# Altium project mt-kgreen-01.PrjPcb
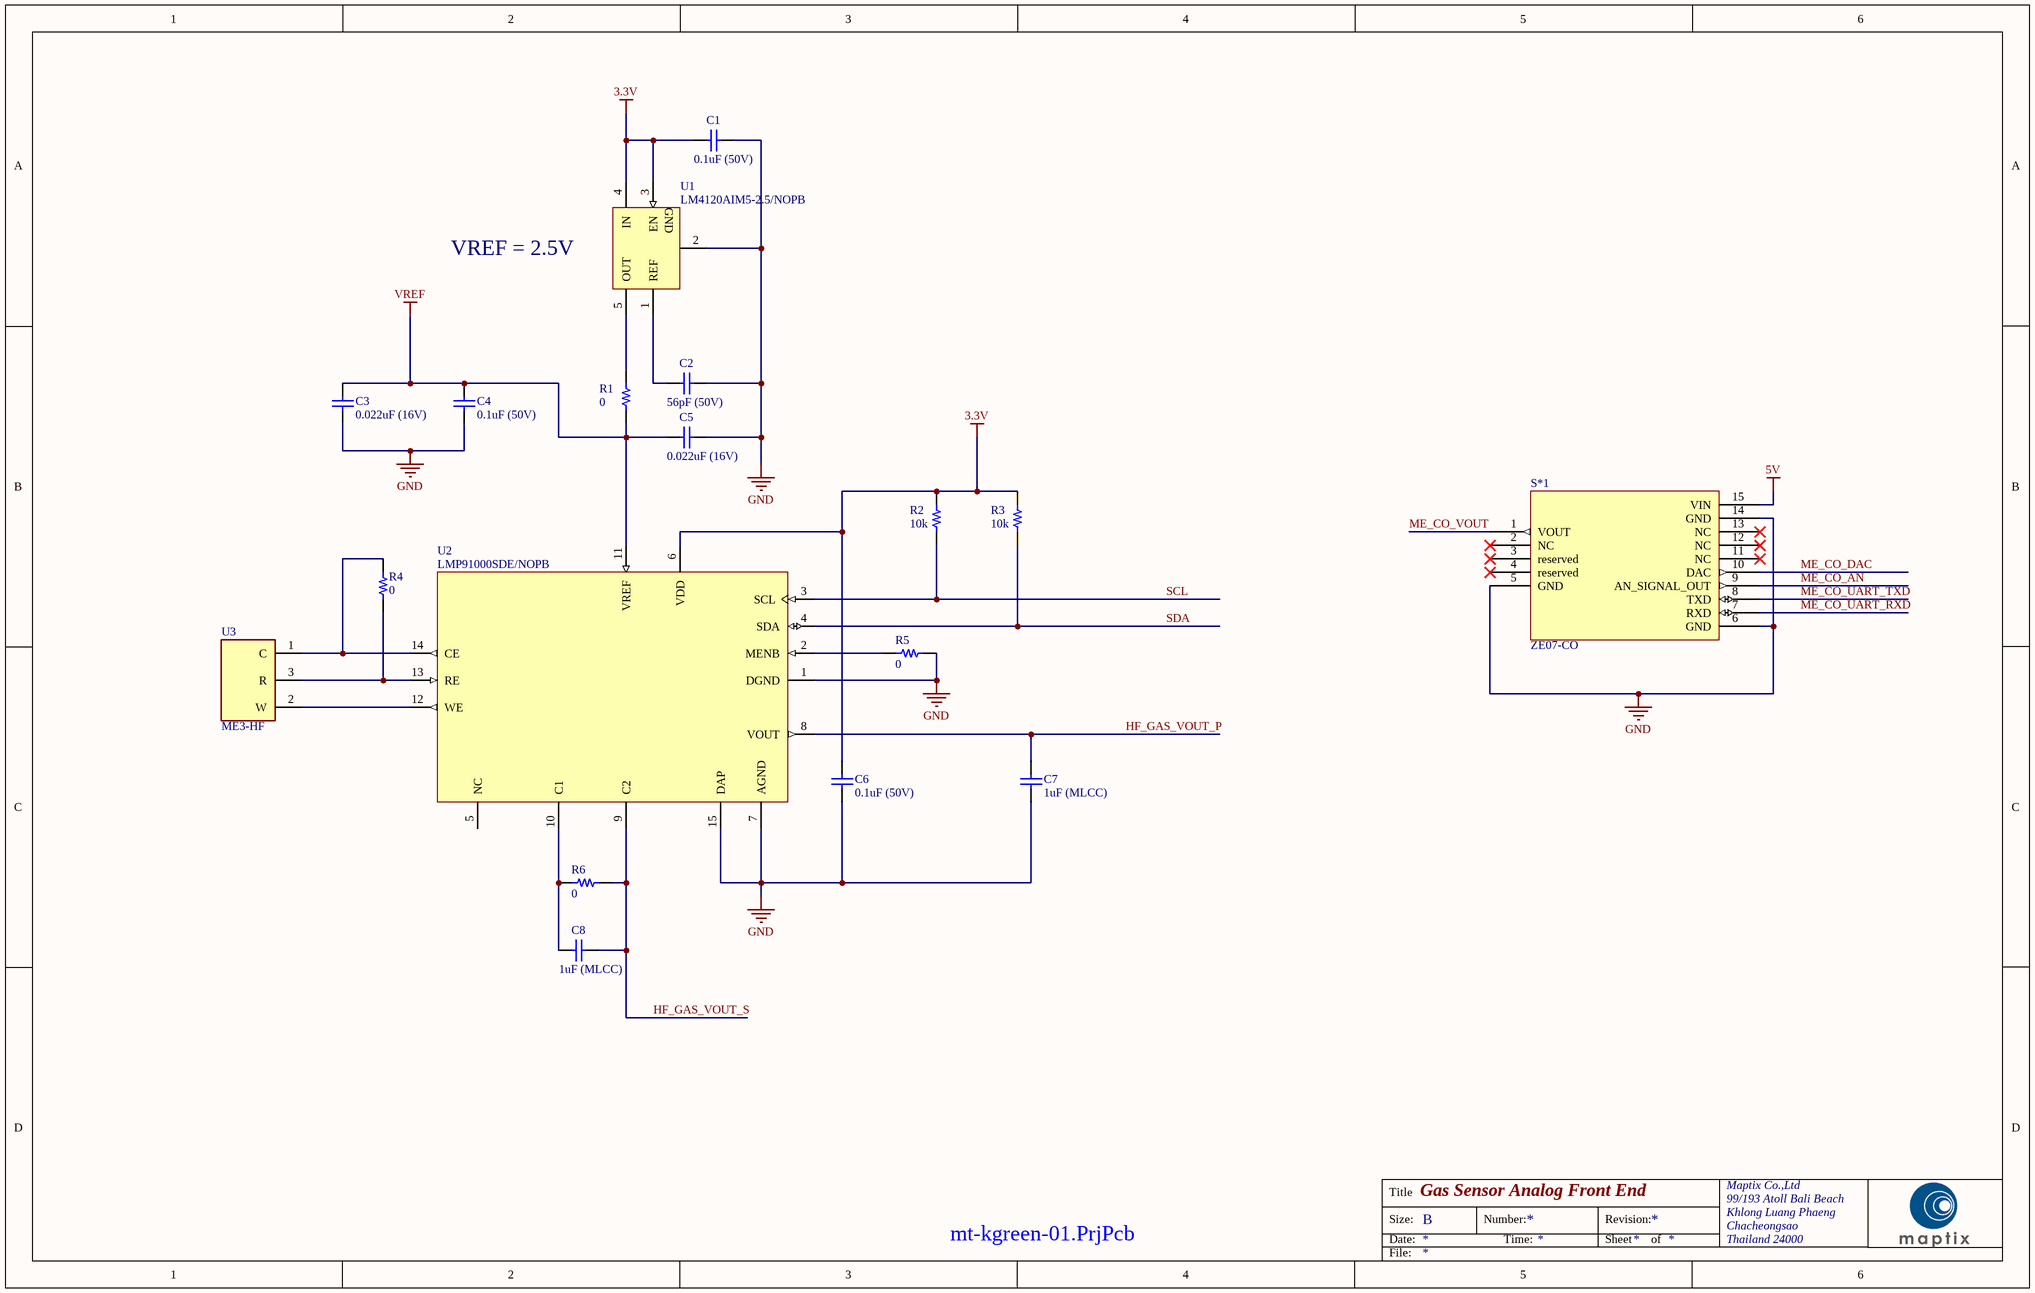
[diagram p0: gas-sensor.SchDoc]
4 sheets, 78 parts. Net scope: global (net labels, ports and power ports of the same name join across sheets).
Board file: mt-kugreen-01.PcbDoc
Sheets:
  gas-sensor.SchDoc
  power-supply.SchDoc
  Controller.SchDoc
  communication.SchDoc

## Sheet gas-sensor.SchDoc: Gas Sensor Analog Front End
size B

### Parts
C1  0.1uF (50V)  [CAPC1608X95X40NL15T15]
C2  56pF (50V)  [CAPC1608X95X40NL15T15]
C3  0.022uF (16V)  [CAPC1608X95X40NL15T15]
C4  0.1uF (50V)  [CAPC1608X95X40NL15T15]
C5  0.022uF (16V)  [CAPC1608X95X40NL15T15]
C6  0.1uF (50V)  [CAPC1608X95X40NL15T15]
C7  1uF (MLCC)  [CAPC1608X95X40NL15T15]
C8  1uF (MLCC)  [CAPC1608X95X40NL15T15]
R1  0  [RES 0603_1608]
R2  10k  [RES 0603_1608]
R3  10k  [RES 0603_1608]
R4  0  [RES 0603_1608]
R5  0  [RES 0603_1608]
R6  0  [RES 0603_1608]
S*1  ZE07-CO  [ZE07-CO]
U1  LM4120AIM5-2.5/NOPB  [MF05A_M]
U2  LMP91000SDE/NOPB  [NHL0014B_V_Pae]
U3  ME3-HF  [ME3SO2]

### Nets
3.3V: C1.2 C6.2 R2.2 R3.2 U1.3(EN) U1.4(IN) U2.6(VDD)
5V: S*1.15(VIN)
GND: C1.1 C2.1 C3.2 C4.1 C5.1 C6.1 C7.2 R5.1 S*1.5(GND) S*1.6(GND) S*1.14(GND) U1.2(GND) U2.1(DGND) U2.7(AGND) U2.15(DAP)
VREF: C3.1 C4.2 C5.2 R1.1 U2.11(VREF)
HF_GAS_VOUT_P: C7.1 U2.8(VOUT)
HF_GAS_VOUT_S: C8.1 R6.1 U2.9(C2)
ME_CO_AN: S*1.9(AN_SIGNAL_OUT)
ME_CO_DAC: S*1.10(DAC)
ME_CO_UART_RXD: S*1.7(RXD)
ME_CO_UART_TXD: S*1.8(TXD)
ME_CO_VOUT: S*1.1(VOUT)
SCL: R2.1 U2.3(SCL)
SDA: R3.1 U2.4(SDA)
NetC2_2: C2.2 U1.1(REF)
NetC8_2: C8.2 R6.2 U2.10(C1)
NetR1_2: R1.2 U1.5(OUT)
NetR4_1: R4.1 U2.14(CE) U3.1(C)
NetR4_2: R4.2 U2.13(RE) U3.3(R)
NetR5_2: R5.2 U2.2(MENB)
NetU2_12: U2.12(WE) U3.2(W)

Not connected (* = marked no-connect by the designer): S*1 2(NC)* 3(reserved)* 4(reserved)* 11(NC)* 12(NC)* 13(NC)*; U2 5(NC)

### Notes on the sheet
- VREF = 2.5V
- Title
- Size:
- Date:
- B
- Number:
- Time:
- Revision:
- Sheet
- of
- Maptix Co.,Ltd
- 99/193 Atoll Bali Beach
- Khlong Luang Phaeng
- Chacheongsao
- Thailand 24000
- File:

### Library data of the parts
C1-C8 = CMP-2006-00072-1: Part Number: VJ0603Y332JXACW1BC; Manufacturer: Vitramon
R1-R6 = CRCW060329K4FKEA: Resistor; Manufacturer: Vishay Dale; Power (Watts): 0.1W, 1/10W; Resistance: 29.4 kOhms; Temperature Coefficient: ±100ppm/°C; Tolerance: ±1%; Part Number: CRCW060329K4FKEA; ComponentLink1Description: Datasheet; ComponentLink1URL: http://www.vishay.com/docs/20035/dcrcwe3.pdf; ComponentLink2Description: DigiKey Link; ComponentLink2URL: http://digikey.com/product-detail/en/vishay-dale/CRCW060329K4FKEA/541-29.4KHCT-ND/1179975; Composition: Thick Film; Device Package: 0603 (1608 Metric); Features: Automotive AEC-Q200; Height - Seated (Max): 0.020" (0.50mm); LastUpdated: 1/2/2020 12:06:58 AM; Lifecycle Status: Active; Minimum Order: 1; Number of Terminations: 2; Operating Temperature: -55°C ~ 155°C; Package / Case: 0603 (1608 Metric); Packaging: TapeAndReel; PartId: 7975; Part Status: Active; Price: 0.00; Ratings: AEC-Q200; Series: CRCW; Size / Dimension: 0.061" L x 0.033" W (1.55mm x 0.85mm); Supplier 1: DigiKey; Supplier Part Number 1: 541-29.4KHCT-ND; Supplier Device Package: 0603
  R1 R4-R6: Value: 0
  R2 R3: Value: 10k
U1 = CMP-0074-00248-2: Precision Micropower Low Dropout Voltage Reference, 5-pin SOT-23, Pb-Free; Manufacturer: National Semiconductor; PowerWise: Y; CompType: Voltage Reference IC; PackageTopMarking: R08A*XTT; PackageVersion: revD, Aug-2008; ComponentLink1Description: LM4120 Datasheet; ComponentLink3Description: MF05A Package Page; DatasheetVersion: Mar-2005; ComponentLink2Description: LM4120 Web Page; PinCount: 5; RevisionNote: Component URLs added; PackageDescription: Molded SOT-23, .115 x .063 x .040 in Body, 5 Lead, .0375 in Pitch; PackageReference: MF05A; RoHS: Y; ComponentLink2URL: http://www.national.com/pf/LM/LM4120.html; ComponentLink3URL: http://www.national.com/packaging/folders/mf05a.html; ComponentLink1URL: http://www.national.com/ds/LM/LM4120.pdf
U2 = CMP-0064-00201-2: Configurable AFE Potentiostat for Low-Power Chemical Sensing Applications, 14-pin LLP, 250 Reel; Manufacturer: Texas Instruments; PowerWise: N; PackageTopMarking: NS*UZXYTT*L91000; CompType: OtherParts; PackageDescription: LLP, Plastic, Dual, 4 x 4 x 0.8mm Body, 14 Lead, 0.5mm Pitch, No Pullback; ComponentLink1URL: http://www.ti.com/general/docs/lit/getliterature.tsp?genericPartNumber=LMP91000&fileType=pdf; ComponentLink1Description: Datasheet URL; PinCount: 14; RoHS: Y; PackageReference: NHL0014B
U3 = ME3-SO2: Undefined or Miscellaneous; Manufacturer_Name: WINSEN; Datasheet Link: http://www.eleparts.co.kr/data/goods_old/design/product_file/SENSOR/gas/ME3-SO2%200-20ppm(ver1.2)%20Manual.pdf; Height: 16.4mm; Manufacturer_Part_Number: ME3-SO2

## Sheet power-supply.SchDoc
size B
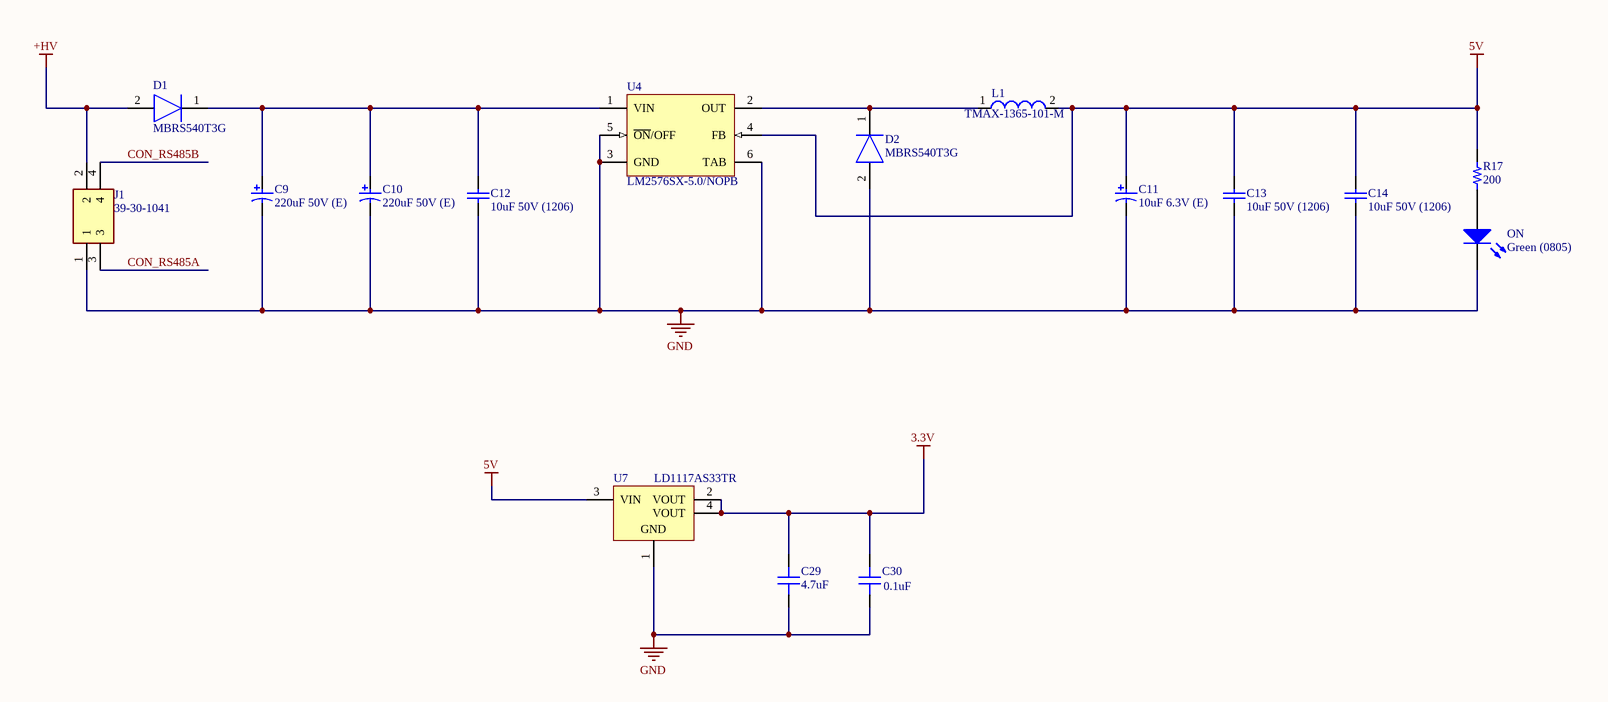
[diagram p1: power-supply.SchDoc]

### Parts
C9  220uF 50V (E)  [PNSC-EEE-1HA221P_L]
C10  220uF 50V (E)  [PNSC-EEE-1HA221P_L]
C11  10uF 6.3V (E)  [NIC-CAPA2-8X10_V]
C12  10uF 50V (1206)  [CAPC3216X229X50LL20T25]
C13  10uF 50V (1206)  [CAPC3216X229X50LL20T25]
C14  10uF 50V (1206)  [CAPC3216X229X50LL20T25]
C29  4.7uF  [CAP 1206_3216 - 1.8MM]
C30  0.1uF  [CAP 0603_1608]
D1  MBRS540T3G  [DIOM7958X256N]
D2  MBRS540T3G  [DIOM7958X256N]
J1  39-30-1041  [39-30-1040]
L1  TMAX-1365-101-M  [WE-HCI-1365]
ON  Green (0805)  [0805_A]
R17  200  [RES 0603_1608]
U4  LM2576SX-5.0/NOPB  [KTT0005B_M]
U7  LD1117AS33TR  [SOT-223_M]

### Nets
3.3V: C29.2 C30.2 U7.2(VOUT) U7.4(VOUT)
5V: C11.1 C13.2 C14.2 L1.2 R17.2 U4.4(FB) U7.3(VIN)
+HV: D1.2(A) J1.2
GND: C9.2 C10.2 C11.2 C12.1 C13.1 C14.1 C29.1 C30.1 D2.2(A) J1.1 ON.1(K) U4.3(GND) U4.5(~{ON}/OFF) U4.6(TAB) U7.1(GND)
CON_RS485A: J1.3
CON_RS485B: J1.4
NetC9_1: C9.1 C10.1 C12.2 D1.1(K) U4.1(VIN)
NetD2_1: D2.1(K) L1.1 U4.2(OUT)
NetON_2: ON.2(A) R17.1

### Notes on the sheet
- Title
- Size:
- Date:
- B
- Number:
- Time:
- Revision:
- Sheet
- of
- Maptix Co.,Ltd
- 99/193 Atoll Bali Beach
- Khlong Luang Phaeng
- Chacheongsao
- Thailand 24000
- File:

### Library data of the parts
C9 C10 = CMP-2000-06200-1: Aluminum Electrolytic Capacitor, 220 uF, +/- 20%, 50 V, -40 to 85 degC, 2-Pin SMD, RoHS, Tape and Reel; Manufacturer: Panasonic; Lifetime @ Temperature: 2000hours@85°C; AE Capacitor Case: RadialCan-SMD; Capacitance: 220µF; Ripple Current AC: 300mA; SVHC: ToBeAdvised; Product Range: PANASONIC-SSeries; Datasheet Version: 11/2012; Manufacturer URL: http://www.panasonic.com/; Packaging: CutTape; Life Time @ Temperature: 2000hours@85°C; Capacitor Case Style: RadialCan-SMD; Capacitance Tolerance ±: ±20%; Mounting Technology: SurfaceMount; Operating Temperature Max: 85°C; Capacitance Tolerance: ±20%; Package Description: 2-Pin Surface Mount Device, Body 10.3 x 10.3 mm; Voltage Rating: 50V; Package Reference: SMD; Diameter: 10mm; Height: 10.2mm; Operating Temperature Min: -40°C; Datasheet URL: http://datasheet.octopart.com/EEE-1HA221P-Panasonic-datasheet-13265900.pdf
C11 = CMP-0687-00071-1: Aluminum Electrolytic Capacitor, UD Series, Low Impedance, 1000 uF, 6.3 V, + / - 20%, -55 to 105 degC, Chip Type, 8 x 10 mm D x L, Pb-Free, Reel; Manufacturer: Nichicon; PartNumber: UUD0J102MNL1GS; Impedance: 0.17 Ohm; Endurance Time: 5000 h; Rated Capacitance: 1000 uF; Rated Ripple Current (at 100kHz): 450 mA; Packing: Dia382mm Reel; Tolerance Rated Capacitance: -20 to 20%; Diameter: 8 mm; ComponentLink3Description: Package Specification; Mounting Technology: Surface Mount; RoHS: TRUE; ComponentLink3URL: http://products.nichicon.co.jp/en/pdf/XJA043/e-ud.pdf; Length: 10 mm; PackageDescription: 2-Pin Surface Mount Device, Diameter 8 mm, Height 10 mm, Pitch 6.5 mm; DatasheetVersion: 08/2012; ComponentLink2Description: Datasheet; ComponentLink1URL: http://www.nichicon.co.jp/; ComponentLink1Description: Manufacturer URL; Rated Voltage: 6.3 V; ComponentLink2URL: http://products.nichicon.co.jp/en/pdf/XJA043/e-ud.pdf; PackageReference: CAPAE-D8H10
C12-C14 = CMP-2000-05863-1: Chip Capacitor, 10 uF, +/- 10%, 25 V, -55 to 85 degC, 1206 (3216 Metric), RoHS, Tape and Reel; Manufacturer: AVX; Rated Voltage: 25V; Dielectric: X5R; Capacitance: 10µF; Mounting Technology: SurfaceMount; Package Reference: 1206; Tolerance (%): ±10%; Manufacturer URL: http://www.avx.com/; Datasheet URL: http://datasheets.avx.com/cx5r.pdf; Package Description: 2-Pin Surface Mount Device, Body 3.2 x 1.6 mm; Datasheet Version: 05/2016; Case Size/Dimension: 1206
C29 = C1206C335K4PACTU: CAP CERAMIC 16V X5R 1206; Manufacturer: KEMET; Capacitance: 3.3µF; Tolerance: ±10%; Part Number: C1206C335K4PACTU; Value: 4.7uF; Applications: General Purpose; ComponentLink1Description: Datasheet; ComponentLink1URL: https://api.kemet.com/component-edge/download/datasheet/C1206C335K4PACTU.pdf; ComponentLink2Description: DigiKey Link; ComponentLink2URL: http://digikey.com/product-detail/en/kemet/C1206C335K4PACTU/399-1264-1-ND/411539; Device Package: 1206 (3216 Metric); LastUpdated: 1/2/2020 12:03:41 AM; Lifecycle Status: Active; Minimum Order: 1; Mounting Type: Surface Mount, MLCC; Operating Temperature: -55°C ~ 85°C; Package / Case: 1206 (3216 Metric); Packaging: ReReel; PartId: 19546; Part Status: Active; Price: 0.00; Series: SMD Comm X5R; Size / Dimension: 0.126" L x 0.063" W (3.20mm x 1.60mm); Supplier 1: DigiKey; Supplier Part Number 1: 399-1264-1-ND; Temperature Coefficient: X5R; Thickness (Max): 0.071" (1.80mm); Voltage - Rated: 16V
C30 = VJ0603Y332JXACW1BC: CAP CERAMIC 50V X7R 0603; Manufacturer: Vishay Vitramon; Capacitance: 3300pF; Tolerance: ±5%; Part Number: VJ0603Y332JXACW1BC; Value: 0.1uF; Applications: General Purpose; ComponentLink1Description: Datasheet; ComponentLink1URL: https://www.vishay.com/docs/28548/vjw1bcbascomseries.pdf; ComponentLink2Description: DigiKey Link; ComponentLink2URL: http://digikey.com/product-detail/en/vishay-vitramon/VJ0603Y332JXACW1BC/720-VJ0603Y332JXACW1BCCT-ND/11198425; Device Package: 0603 (1608 Metric); LastUpdated: 1/2/2020 12:01:35 AM; Lifecycle Status: Active; Minimum Order: 1; Mounting Type: Surface Mount, MLCC; Operating Temperature: -55°C ~ 125°C; Package / Case: 0603 (1608 Metric); Packaging: Unknown; PartId: 26247; Part Status: Active; Price: 0.00; Series: VJ; Size / Dimension: 0.063" L x 0.031" W (1.60mm x 0.80mm); Supplier 1: DigiKey; Supplier Part Number 1: 720-VJ0603Y332JXACW1BCCT-ND; Temperature Coefficient: X7R; Thickness (Max): 0.034" (0.87mm); Voltage - Rated: 50V
D1 D2 = MBRS540T3G: Diode; Manufacturer_Name: ON Semiconductor; Allied_Number: 70100196; Datasheet Link: http://www.onsemi.com/pub/Collateral/MBRS540T3-D.PDF; Height: 2.56mm; Manufacturer_Part_Number: MBRS540T3G; Mouser Part Number: 863-MBRS540T3G; Mouser Price/Stock: https://www.mouser.com/Search/Refine.aspx?Keyword=863-MBRS540T3G; RS Part Number: 6880512; RS Price/Stock: https://uk.rs-online.com/web/p/products/6880512; Allied Price/Stock: http://www.alliedelec.com/on-semiconductor-mbrs540t3g/70100196/
J1 = 39-30-1041: Connector; Manufacturer_Name: Molex; Allied_Number: 70374118; Datasheet Link: http://docs-emea.rs-online.com/webdocs/150e/0900766b8150e03e.pdf; Manufacturer_Part_Number: 39-30-1041; Mouser Part Number: 538-39-30-1041; Mouser Price/Stock: https://www.mouser.com/Search/Refine.aspx?Keyword=538-39-30-1041; RS Part Number: 6705754; RS Price/Stock: https://uk.rs-online.com/web/p/products/6705754; Allied Price/Stock: https://www.alliedelec.com/molex-incorporated-39-30-1041/70374118/
L1 = CMP-1351-00012-1: SMD Flat Wire High Current Inductor WE-HCI, L=33.0 µH; Manufacturer: Wuerth Elektronik; PartNumber: 7443551331; Inductance: 33.0 ÂµH; ComponentLink1Description: Manufacturer URL; ComponentLink1URL: http://www.we-online.com; PackageDescription: Inductor, 2-Leads, Body 13.2 x 12.8 mm; ComponentLink2URL: http://katalog.we-online.de/kataloge/eisos/media/pdf/7443551331.pdf; ComponentLink2Description: Datasheet; PackageReference: WE-HCI-1365
ON = CMP-1426-00007-1: SMD mono-color Chip LED, WL-SMCW, Green; PartNumber: 150080GS75000; Manufacturer: Wuerth Elektronik; PackageReference: 0805_A; Color: Green; ComponentLink2URL: http://katalog.we-online.com/led/datasheet/150080GS75000.pdf; ComponentLink1URL: http://www.we-online.com; ComponentLink1Description: Manufacturer URL; ComponentLink2Description: Datasheet
R17 = CRCW060329K4FKEA: as R1 on sheet gas-sensor; Part Number: CRCW060329K4FKEA; Value: 200; ComponentLink1Description: Datasheet; ComponentLink1URL: http://www.vishay.com/docs/20035/dcrcwe3.pdf; ComponentLink2Description: DigiKey Link; ComponentLink2URL: http://digikey.com/product-detail/en/vishay-dale/CRCW060329K4FKEA/541-29.4KHCT-ND/1179975; Composition: Thick Film; Device Package: 0603 (1608 Metric); Features: Automotive AEC-Q200; Height - Seated (Max): 0.020" (0.50mm); LastUpdated: 1/2/2020 12:06:58 AM; Lifecycle Status: Active; Minimum Order: 1; Number of Terminations: 2; Operating Temperature: -55°C ~ 155°C; Package / Case: 0603 (1608 Metric); Packaging: TapeAndReel; PartId: 7975; Part Status: Active; Price: 0.00; Ratings: AEC-Q200; Series: CRCW; Size / Dimension: 0.061" L x 0.033" W (1.55mm x 0.85mm); Supplier 1: DigiKey; Supplier Part Number 1: 541-29.4KHCT-ND; Supplier Device Package: 0603
U4 = CMP-0069-00122-3: SIMPLE SWITCHER® 3A Step-Down Voltage Regulator, 5-pin TO-263, Pb-Free; Manufacturer: Texas Instruments; PackageTopMarking: NSUZXYTTE#*LM2576S*-5.0 P+; PowerWise: N; PackageDescription: TO-263, Molded, .400 x .390 x .180in, 5 Lead, .067in Pitch, Surface Mount; PinCount: 5; PackageReference: KTT0005B; ComponentLink1Description: Datasheet URL; ComponentLink1URL: http://www.ti.com/general/docs/lit/getliterature.tsp?genericPartNumber=LM2576&fileType=pdf; Code_JEDEC: MO-169-AB; CompType: Switcher; RoHS: Y
U7 = CMP-0244-00316-1: 1A, Low Drop Positive Voltage Regulator, 3.3V, 4-Pin SOT-223, Tape and Reel; ComponentLink1Description: Manufacturer URL; DatasheetVersion: 2/12/2011; PackageVersion: 2010; ComponentLink1URL: http://www.st.com; ComponentLink2Description: Datasheet; ComponentLink2URL: http://www.st.com/internet/com/TECHNICAL_RESOURCES/TECHNICAL_LITERATURE/DATASHEET/CD00002116.pdf; PackageDescription: 4-Pin SOT-223 Package, 6.5 x 3.5 mm Body, 2.3 mm Pitch, 7 mm Lead Span; PackageReference: SOT-223

## Sheet Controller.SchDoc: Controller-Section
size B
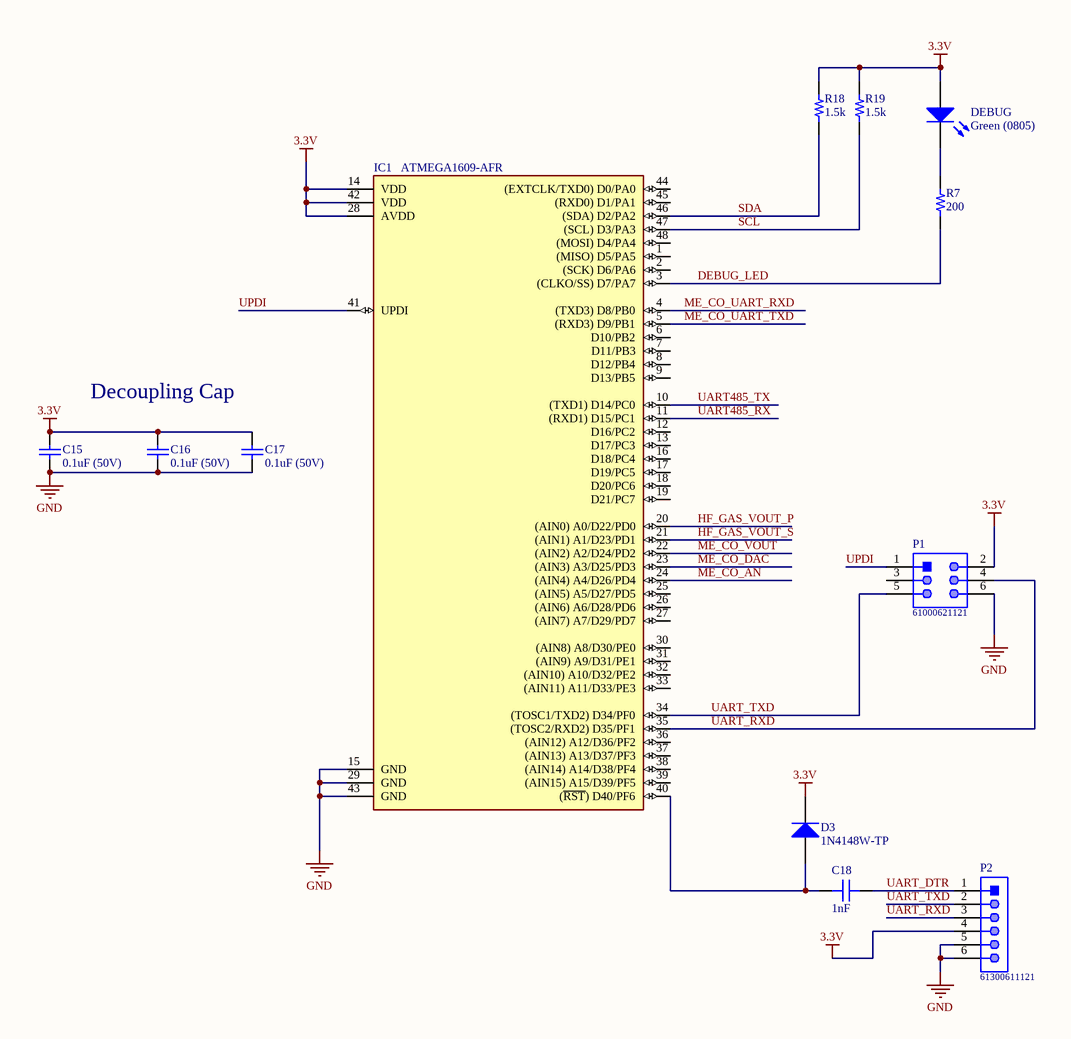
[diagram p2: Controller.SchDoc]

### Parts
C15  0.1uF (50V)  [CAPC1608X95X40NL15T15]
C16  0.1uF (50V)  [CAPC1608X95X40NL15T15]
C17  0.1uF (50V)  [CAPC1608X95X40NL15T15]
C18  1nF  [CAP 0603_1608]
D3  1N4148W-TP  [MCC-SOD123_V]
DEBUG  Green (0805)  [0805_A]
IC1  ATMEGA1609-AFR  [QFP50P900X900X120-48N]
P1  61000621121  [61000621121]
P2  61300611121  [61300611121]
R7  200  [RES 0603_1608]
R18  1.5k  [RES 0603_1608]
R19  1.5k  [RES 0603_1608]

### Nets
3.3V: C15.2 C16.2 C17.2 D3.2(K) DEBUG.2(A) IC1.14(VDD) IC1.28(AVDD) IC1.42(VDD) P1.2 P2.4 R18.1 R19.1
GND: C15.1 C16.1 C17.1 IC1.15(GND) IC1.29(GND) IC1.43(GND) P1.6 P2.5 P2.6
DEBUG_LED: IC1.3((CLKO/SS)_D7/PA7) R7.1
HF_GAS_VOUT_P: IC1.20((AIN0)_A0/D22/PD0)
HF_GAS_VOUT_S: IC1.21((AIN1)_A1/D23/PD1)
ME_CO_AN: IC1.24((AIN4)_A4/D26/PD4)
ME_CO_DAC: IC1.23((AIN3)_A3/D25/PD3)
ME_CO_UART_RXD: IC1.4((TXD3)_D8/PB0)
ME_CO_UART_TXD: IC1.5((RXD3)_D9/PB1)
ME_CO_VOUT: IC1.22((AIN2)_A2/D24/PD2)
SCL: IC1.47((SCL)_D3/PA3) R19.2
SDA: IC1.46((SDA)_D2/PA2) R18.2
UART485_RX: IC1.11((RXD1)_D15/PC1)
UART485_TX: IC1.10((TXD1)_D14/PC0)
UART_DTR: C18.1 P2.1
UART_RXD: IC1.35((TOSC2/RXD2)_D35/PF1) P1.4 P2.3
UART_TXD: IC1.34((TOSC1/TXD2)_D34/PF0) P1.5 P2.2
UPDI: IC1.41(UPDI) P1.1
NetC18_2: C18.2 D3.1(A) IC1.40((~{RST})_D40/PF6)
NetDEBUG_1: DEBUG.1(K) R7.2

Not connected (* = marked no-connect by the designer): IC1 1((MISO)_D5/PA5) 2((SCK)_D6/PA6) 6(D10/PB2) 7(D11/PB3) 8(D12/PB4) 9(D13/PB5) 12(D16/PC2) 13(D17/PC3) 16(D18/PC4) 17(D19/PC5) 18(D20/PC6) 19(D21/PC7) 25((AIN5)_A5/D27/PD5) 26((AIN6)_A6/D28/PD6) 27((AIN7)_A7/D29/PD7) 30((AIN8)_A8/D30/PE0) 31((AIN9)_A9/D31/PE1) 32((AIN10)_A10/D32/PE2) 33((AIN11)_A11/D33/PE3) 36((AIN12)_A12/D36/PF2) 37((AIN13)_A13/D37/PF3) 38((AIN14)_A14/D38/PF4) 39((AIN15)_A15/D39/PF5) 44((EXTCLK/TXD0)_D0/PA0) 45((RXD0)_D1/PA1) 48((MOSI)_D4/PA4); P1 3

### Notes on the sheet
- Decoupling Cap
- Title
- Size:
- Date:
- B
- Number:
- Time:
- Revision:
- Sheet
- of
- Maptix Co.,Ltd
- 99/193 Atoll Bali Beach
- Khlong Luang Phaeng
- Chacheongsao
- Thailand 24000
- File:

### Library data of the parts
C15-C17 = CMP-2006-00072-1: as C1 on sheet gas-sensor
C18 = VJ0603Y332JXACW1BC: as C30 on sheet power-supply; Part Number: VJ0603Y332JXACW1BC; Value: 1nF; Applications: General Purpose; ComponentLink1Description: Datasheet; ComponentLink1URL: https://www.vishay.com/docs/28548/vjw1bcbascomseries.pdf; ComponentLink2Description: DigiKey Link; ComponentLink2URL: http://digikey.com/product-detail/en/vishay-vitramon/VJ0603Y332JXACW1BC/720-VJ0603Y332JXACW1BCCT-ND/11198425; Device Package: 0603 (1608 Metric); LastUpdated: 1/2/2020 12:01:35 AM; Lifecycle Status: Active; Minimum Order: 1; Mounting Type: Surface Mount, MLCC; Operating Temperature: -55°C ~ 125°C; Package / Case: 0603 (1608 Metric); Packaging: Unknown; PartId: 26247; Part Status: Active; Price: 0.00; Series: VJ; Size / Dimension: 0.063" L x 0.031" W (1.60mm x 0.80mm); Supplier 1: DigiKey; Supplier Part Number 1: 720-VJ0603Y332JXACW1BCCT-ND; Temperature Coefficient: X7R; Thickness (Max): 0.034" (0.87mm); Voltage - Rated: 50V
D3 = CMP-2000-04993-1: High Speed Switching Diode, 400 mW, 150 mA, -65 to 150 degC, 2-Pin SOD123, RoHS, Tape and Reel; Manufacturer: Micro Commercial Components; Reverse Recovery Time-Max: 4ns; Average Forward Current-Max: 0.15A; Peak Current-Max: 2A; Power Dissipation: 400mW; Reverse Voltage-Max [Vrrm]: 100V; Datasheet URL: https://datasheet.ciiva.com/16836/1n4148wsod123-16836277.pdf; Package Reference: SOD123; Package URL: http://www.mccsemi.com/up_pdf/1N4448W(SOD-123).pdf; Package Description: 2-Pin Small Outline Diode, Body 2.7 x 1.6 mm, Height 1.35 mm; Manufacturer URL: http://www.mccsemi.com/; Datasheet Version: Rev. C, 07/2014
DEBUG = CMP-1426-00007-1: as ON on sheet power-supply; PackageReference: 0805_A; Color: Green; ComponentLink2URL: http://katalog.we-online.com/led/datasheet/150080GS75000.pdf; ComponentLink1URL: http://www.we-online.com; ComponentLink1Description: Manufacturer URL; ComponentLink2Description: Datasheet
IC1 = ATMEGA1609-AFR: Integrated Circuit; Manufacturer_Name: Microchip; Datasheet Link: https://componentsearchengine.com/Datasheets/1/ATMEGA1609-AFR.pdf; Height: 1.2mm; Manufacturer_Part_Number: ATMEGA1609-AFR; Mouser Part Number: 579-ATMEGA1609-AFR; Mouser Price/Stock: https://www.mouser.com/Search/Refine.aspx?Keyword=579-ATMEGA1609-AFR
P1 = CMP-1502-01024-1: SMT Vertical Pin Header WR-PHD, Pitch 2.54 mm, Dual Row, 6 pins; Manufacturer: Wurth Elektronik; Withstanding Voltage: 500VAC; Contact Resistance: 20mOhm; Working Voltage: 250VAC; Gender: Male; Rated Current: 3A; Pin Number: 6; Pitch: 2.54mm; Part Number: 61000621121; Operating Temperature: -40to125degC; Mounting Technology: SMT; Packaging: Tube; Datasheet URL: https://katalog.we-online.de/em/datasheet/6100xx21121.pdf; Package Reference: 61000621121; Publisher: WurthElektronik; Row Number: Dual; Orientation: Vertical; Manufacturer URL: http://www.we-online.de
P2 = CMP-1502-01070-1: THT Vertical Pin Header WR-PHD, Pitch 2.54 mm, Single Row, 6 pins; Manufacturer: Wurth Elektronik; Gender: Male; Pin Number: 6; Pitch: 2.54mm; Working Voltage: 250VAC; Rated Current: 3A; Withstanding Voltage: 500VAC; Contact Resistance: 20mOhm; Operating Temperature: -40to105degC; Packaging: Bag; Datasheet URL: https://katalog.we-online.de/em/datasheet/6130xx11121.pdf; Package Reference: 61300611121; Mounting Technology: THT; Publisher: WurthElektronik; Part Number: 61300611121; Manufacturer URL: http://www.we-online.de; Row Number: Single; Orientation: Vertical
R7 R18 R19 = CRCW060329K4FKEA: as R1 on sheet gas-sensor; Part Number: CRCW060329K4FKEA; ComponentLink1Description: Datasheet; ComponentLink1URL: http://www.vishay.com/docs/20035/dcrcwe3.pdf; ComponentLink2Description: DigiKey Link; ComponentLink2URL: http://digikey.com/product-detail/en/vishay-dale/CRCW060329K4FKEA/541-29.4KHCT-ND/1179975; Composition: Thick Film; Device Package: 0603 (1608 Metric); Features: Automotive AEC-Q200; Height - Seated (Max): 0.020" (0.50mm); LastUpdated: 1/2/2020 12:06:58 AM; Lifecycle Status: Active; Minimum Order: 1; Number of Terminations: 2; Operating Temperature: -55°C ~ 155°C; Package / Case: 0603 (1608 Metric); Packaging: TapeAndReel; PartId: 7975; Part Status: Active; Price: 0.00; Ratings: AEC-Q200; Series: CRCW; Size / Dimension: 0.061" L x 0.033" W (1.55mm x 0.85mm); Supplier 1: DigiKey; Supplier Part Number 1: 541-29.4KHCT-ND; Supplier Device Package: 0603
  R7: Value: 200
  R18 R19: Value: 1.5k

## Sheet communication.SchDoc: Communication-interface
size B
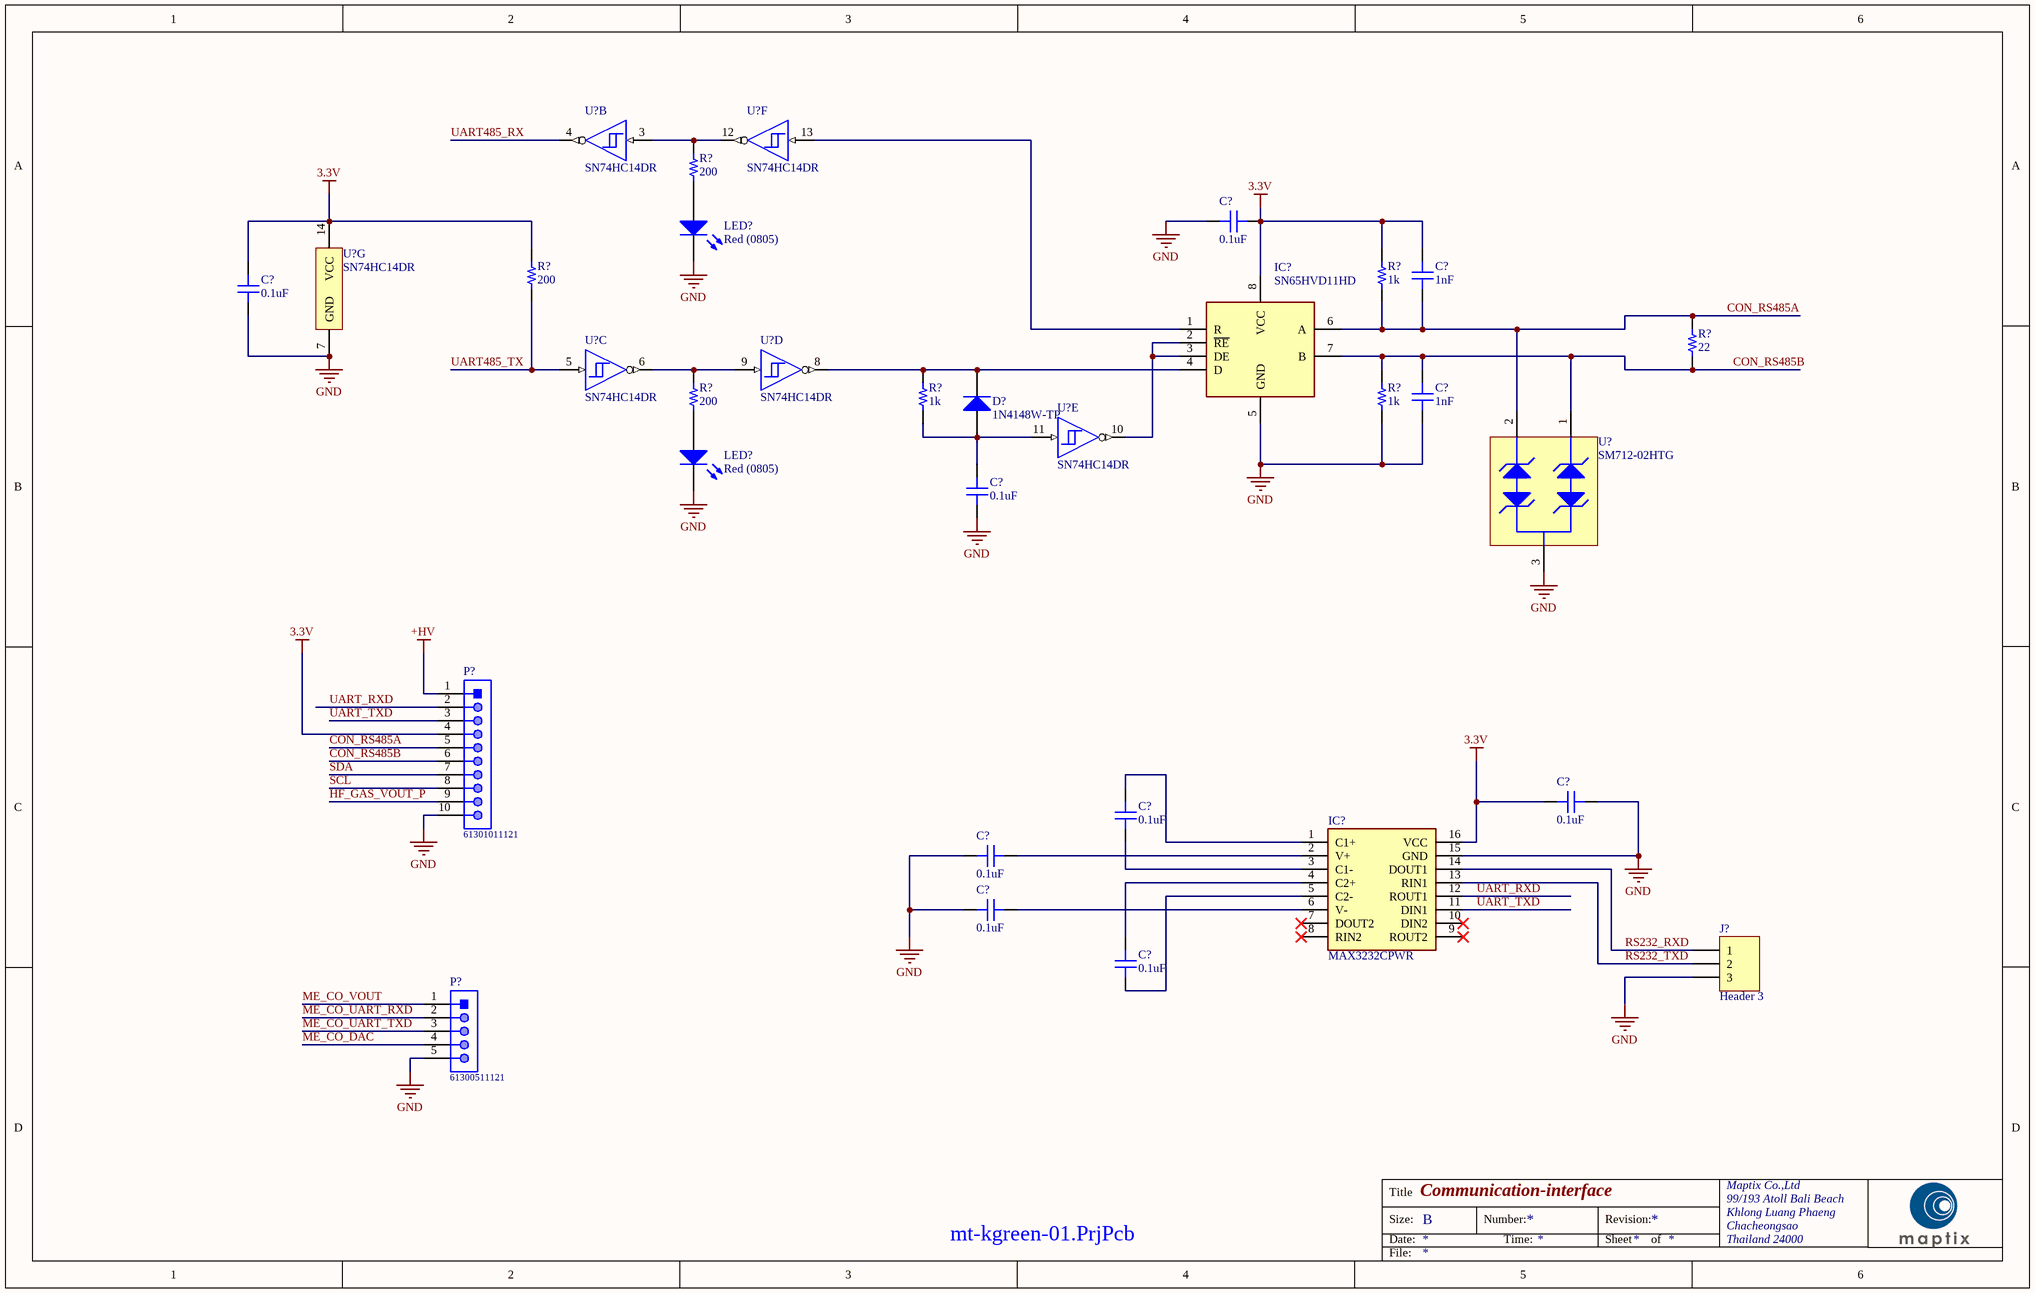
[diagram p3: communication.SchDoc]

### Parts
(Parts that share a designator on the sheet are numbered #1, #2 ... from top to bottom, then left to right.)
C19  0.1uF  [CAP 0603_1608]
C20  1nF  [CAP 0603_1608]
C21  0.1uF  [CAP 0603_1608]
C22  1nF  [CAP 0603_1608]
C23  0.1uF  [CAP 0603_1608]
C24  0.1uF  [CAP 0603_1608]
C25  0.1uF  [CAP 0603_1608]
C26  0.1uF  [CAP 0603_1608]
C27  0.1uF  [CAP 0603_1608]
C28  0.1uF  [CAP 0603_1608]
D4  1N4148W-TP  [MCC-SOD123_V]
IC2  SN65HVD11HD  [SOIC127P600X175-8N]
IC3  MAX3232CPWR  [SOP65P640X120-16N]
J2  Header 3  [HDR1X3]
P3  61301011121  [61301011121]
P?  61300511121  [61300511121]
R8  200  [RES 0603_1608]
R9  200  [RES 0603_1608]
R10  1k  [RES 0603_1608]
R12  22  [RES 0603_1608]
R13  200  [RES 0603_1608]
R14  1k  [RES 0603_1608]
R15  1k  [RES 0603_1608]
RXD  Red (0805)  [0805_A]
TXD  Red (0805)  [0805_A]
U5  SN74HC14DR  [D0014A_N]  (part G of 7)
U6  SM712-02HTG  [LFUS-SOT23-3_V]
U?#1  SN74HC14DR  [D0014A_N]  (part B of 7)
U?#2  SN74HC14DR  [D0014A_N]  (part F of 7)
U?#3  SN74HC14DR  [D0014A_N]  (part C of 7)
U?#4  SN74HC14DR  [D0014A_N]  (part D of 7)
U?#5  SN74HC14DR  [D0014A_N]  (part E of 7)

### Nets
3.3V: C19.2 C20.2 C21.2 C24.1 IC2.8(VCC) IC3.16(VCC) P3.4 R9.2 R10.2 U5.14(VCC)
+HV: P3.1
GND: C19.1 C21.1 C22.1 C23.1 C24.2 C26.1 C27.1 IC2.5(GND) IC3.15(GND) J2.3 P3.10 P?.5 R15.1 RXD.1(K) TXD.1(K) U5.7(GND) U6.3
CON_RS485A: C20.1 IC2.6(A) P3.5 R10.1 R12.2 U6.2
CON_RS485B: C22.2 IC2.7(B) P3.6 R12.1 R15.2 U6.1
HF_GAS_VOUT_P: P3.9
ME_CO_DAC: P?.4
ME_CO_UART_RXD: P?.2
ME_CO_UART_TXD: P?.3
ME_CO_VOUT: P?.1
RS232_RXD: IC3.14(DOUT1) J2.1
RS232_TXD: IC3.13(RIN1) J2.2
SCL: P3.8
SDA: P3.7
UART485_RX: U?#1.4(~{2Y})
UART485_TX: R9.1 U?#3.5(3A)
UART_RXD: IC3.12(ROUT1) P3.2
UART_TXD: IC3.11(DIN1) P3.3
NetC23_2: C23.2 D4.1(A) R14.1 U?#5.11(5A)
NetC25_1: C25.1 IC3.1(C1+)
NetC25_2: C25.2 IC3.3(C1-)
NetC26_2: C26.2 IC3.2(V+)
NetC27_2: C27.2 IC3.6(V-)
NetC28_1: C28.1 IC3.4(C2+)
NetC28_2: C28.2 IC3.5(C2-)
NetD4_2: D4.2(K) IC2.4(D) R14.2 U?#4.8(~{4Y})
NetIC2_1: IC2.1(R) U?#2.13(6A)
NetIC2_2: IC2.2(~{RE}) IC2.3(DE) U?#5.10(~{5Y})
NetR8_1: R8.1 RXD.2(A)
NetR8_2: R8.2 U?#1.3(2A) U?#2.12(~{6Y})
NetR13_1: R13.1 TXD.2(A)
NetR13_2: R13.2 U?#3.6(~{3Y}) U?#4.9(4A)

Not connected (* = marked no-connect by the designer): IC3 7(DOUT2)* 8(RIN2)* 9(ROUT2)* 10(DIN2)*

### Notes on the sheet
- Title
- Size:
- Date:
- B
- Number:
- Time:
- Revision:
- Sheet
- of
- Maptix Co.,Ltd
- 99/193 Atoll Bali Beach
- Khlong Luang Phaeng
- Chacheongsao
- Thailand 24000
- File:

### Library data of the parts
C19-C28 = VJ0603Y332JXACW1BC: as C30 on sheet power-supply
D4 = CMP-2000-04993-1: as D3 on sheet Controller
IC2 = SN65HVD11HD: Integrated Circuit; Manufacturer_Name: Texas Instruments
IC3 = MAX3232CPWR: Integrated Circuit; Manufacturer_Name: Texas Instruments
J2 = Header 3: Header, 3-Pin
P3 = CMP-1502-01082-1: THT Vertical Pin Header WR-PHD, Pitch 2.54 mm, Single Row, 10 pins; Manufacturer: Wurth Elektronik; Contact Resistance: 20mOhm; Rated Current: 3A; Pitch: 2.54mm; Gender: Male; Pin Number: 10; Working Voltage: 250VAC; Withstanding Voltage: 500VAC
P? = CMP-1502-01068-1: THT Vertical Pin Header WR-PHD, Pitch 2.54 mm, Single Row, 5 pins; Manufacturer: Wurth Elektronik; Pin Number: 5; Contact Resistance: 20mOhm; Working Voltage: 250VAC; Pitch: 2.54mm; Withstanding Voltage: 500VAC; Rated Current: 3A; Gender: Male
R8-R10 R12-R15 = CRCW060329K4FKEA: as R1 on sheet gas-sensor
RXD TXD = CMP-1426-00007-1: as ON on sheet power-supply
U5 U?#1-U?#5 = CMP-1615-00273-3: Hex Schmitt-Trigger Inverters, D0014A, LARGE T&R; Manufacturer: Texas Instruments; tpd @ Nom Voltage(Max)(ns): 31; Schmitt Trigger: Yes; Output Drive (IOL/IOH)(Max)(mA): -4/4; F @ Nom Voltage(Max)(Mhz): 20; Technology Family: HC; Output Type: CMOS; VCC(Min)(V): 2; ICC @ Nom Voltage(Max)(mA): 0.02; Bits(#): 6; Rating: Catalog; Voltage(Nom)(V): 5
U6 = CMP-2000-07561-1: TVS Diode Array, 600 W, 12 V, -40 to 125 degC, 3-Pin SOT23, RoHS, Tape and Reel; Manufacturer: Littelfuse; Case\/Package: TO-236-3; Number of Bidirectional Channels: 2; Min Breakdown Voltage: 13.3V; Clamping Voltage: 31V; Direction: Bidirectional; Element Configuration: Dual; Reverse Standoff Voltage: 12V; Max Surge Current: 19A; Leakage Current: 20uA; Capacitance: 75pF; Max Power Dissipation: 600W; Power Line Protection: No

## Nets that join several sheets
3.3V: gas-sensor (7 pins), power-supply (C29.2 C30.2 U7.2 U7.4), Controller (12 pins), communication (10 pins)
5V: gas-sensor (S*1.15), power-supply (7 pins)
+HV: power-supply (D1.2 J1.2), communication (P3.1)
GND: gas-sensor (15 pins), power-supply (15 pins), Controller (9 pins), communication (17 pins)
CON_RS485A: power-supply (J1.3), communication (6 pins)
CON_RS485B: power-supply (J1.4), communication (6 pins)
HF_GAS_VOUT_P: gas-sensor (C7.1 U2.8), Controller (IC1.20), communication (P3.9)
HF_GAS_VOUT_S: gas-sensor (C8.1 R6.1 U2.9), Controller (IC1.21)
ME_CO_AN: gas-sensor (S*1.9), Controller (IC1.24)
ME_CO_DAC: gas-sensor (S*1.10), Controller (IC1.23), communication (P?.4)
ME_CO_UART_RXD: gas-sensor (S*1.7), Controller (IC1.4), communication (P?.2)
ME_CO_UART_TXD: gas-sensor (S*1.8), Controller (IC1.5), communication (P?.3)
ME_CO_VOUT: gas-sensor (S*1.1), Controller (IC1.22), communication (P?.1)
SCL: gas-sensor (R2.1 U2.3), Controller (IC1.47 R19.2), communication (P3.8)
SDA: gas-sensor (R3.1 U2.4), Controller (IC1.46 R18.2), communication (P3.7)
UART485_RX: Controller (IC1.11), communication (U?#1.4)
UART485_TX: Controller (IC1.10), communication (R9.1 U?#3.5)
UART_RXD: Controller (IC1.35 P1.4 P2.3), communication (IC3.12 P3.2)
UART_TXD: Controller (IC1.34 P1.5 P2.2), communication (IC3.11 P3.3)